# EasyEDA schematic BattleBoard.json

## Sheets
1 MCU: TITLE: MCU; REV: 1.0; Date: 2020-04-01; Sheet: 1/1; Drawn By: woodrowdouglass; Company: Your Company
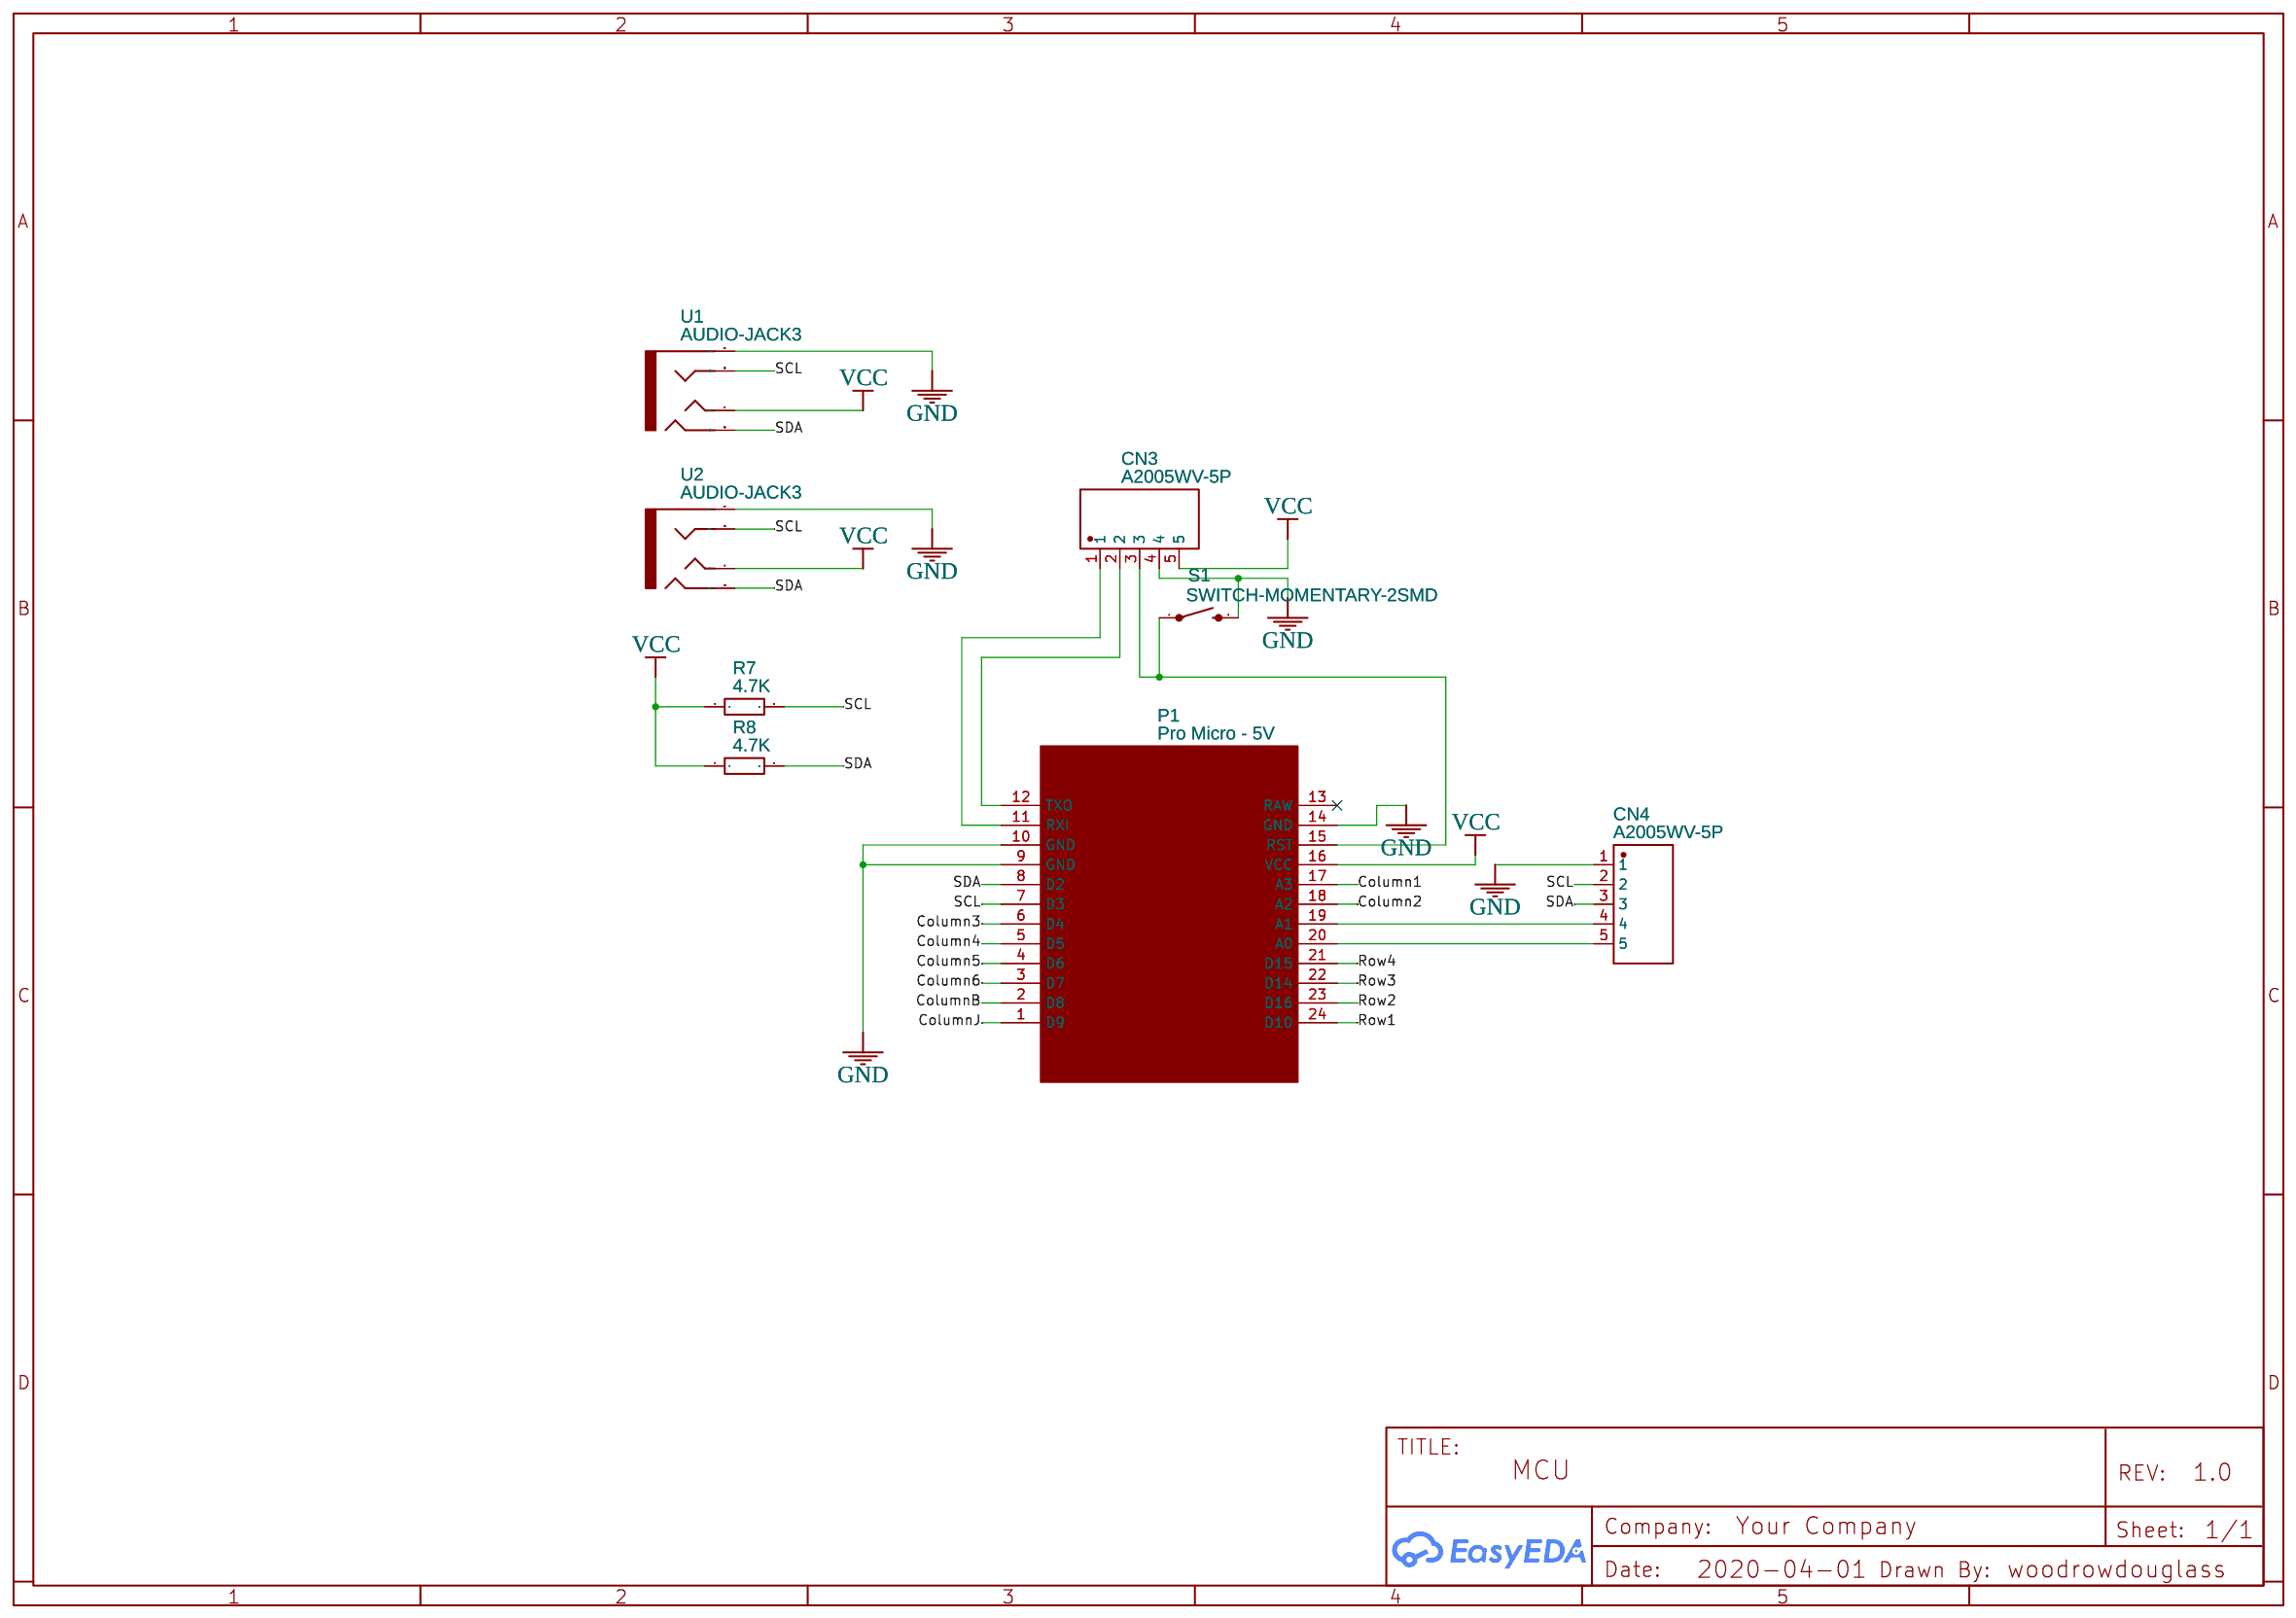
[diagram p0: MCU]
2 ArcadeControls: TITLE: Arcade Controls
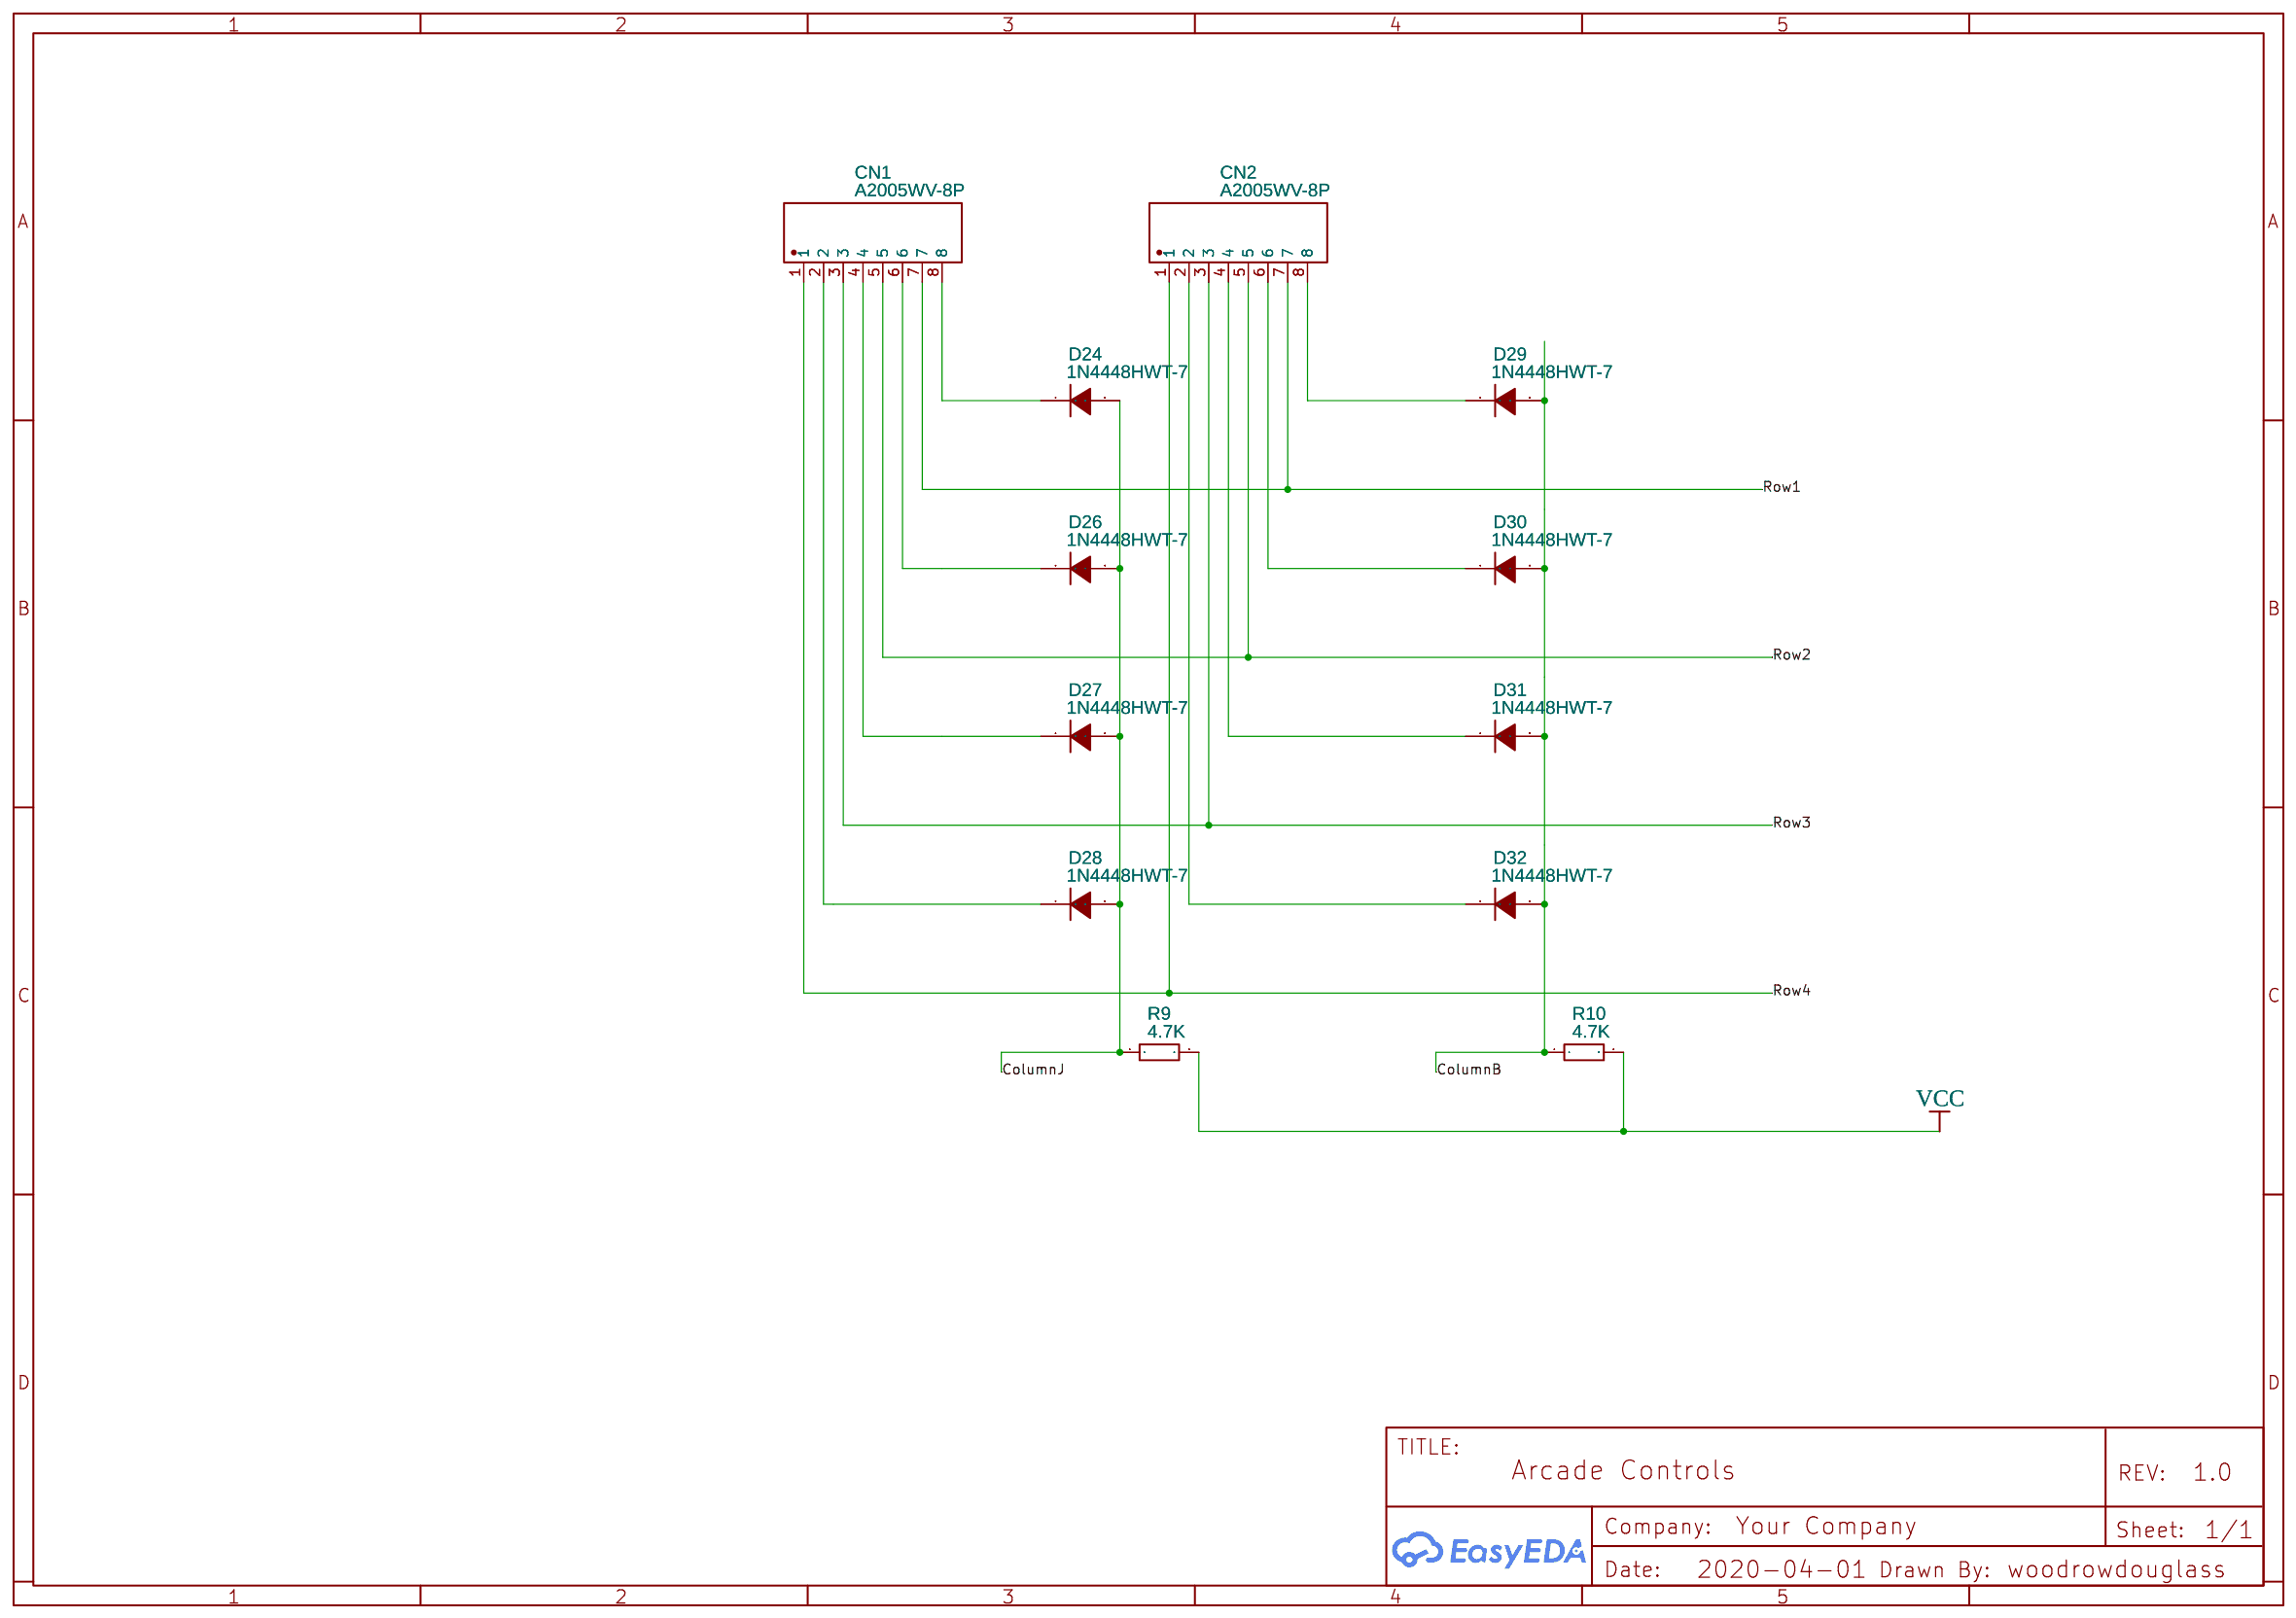
[diagram p1: ArcadeControls]
3 KeyMatrix: TITLE: KeyMatrix; Date: 2019-04-03
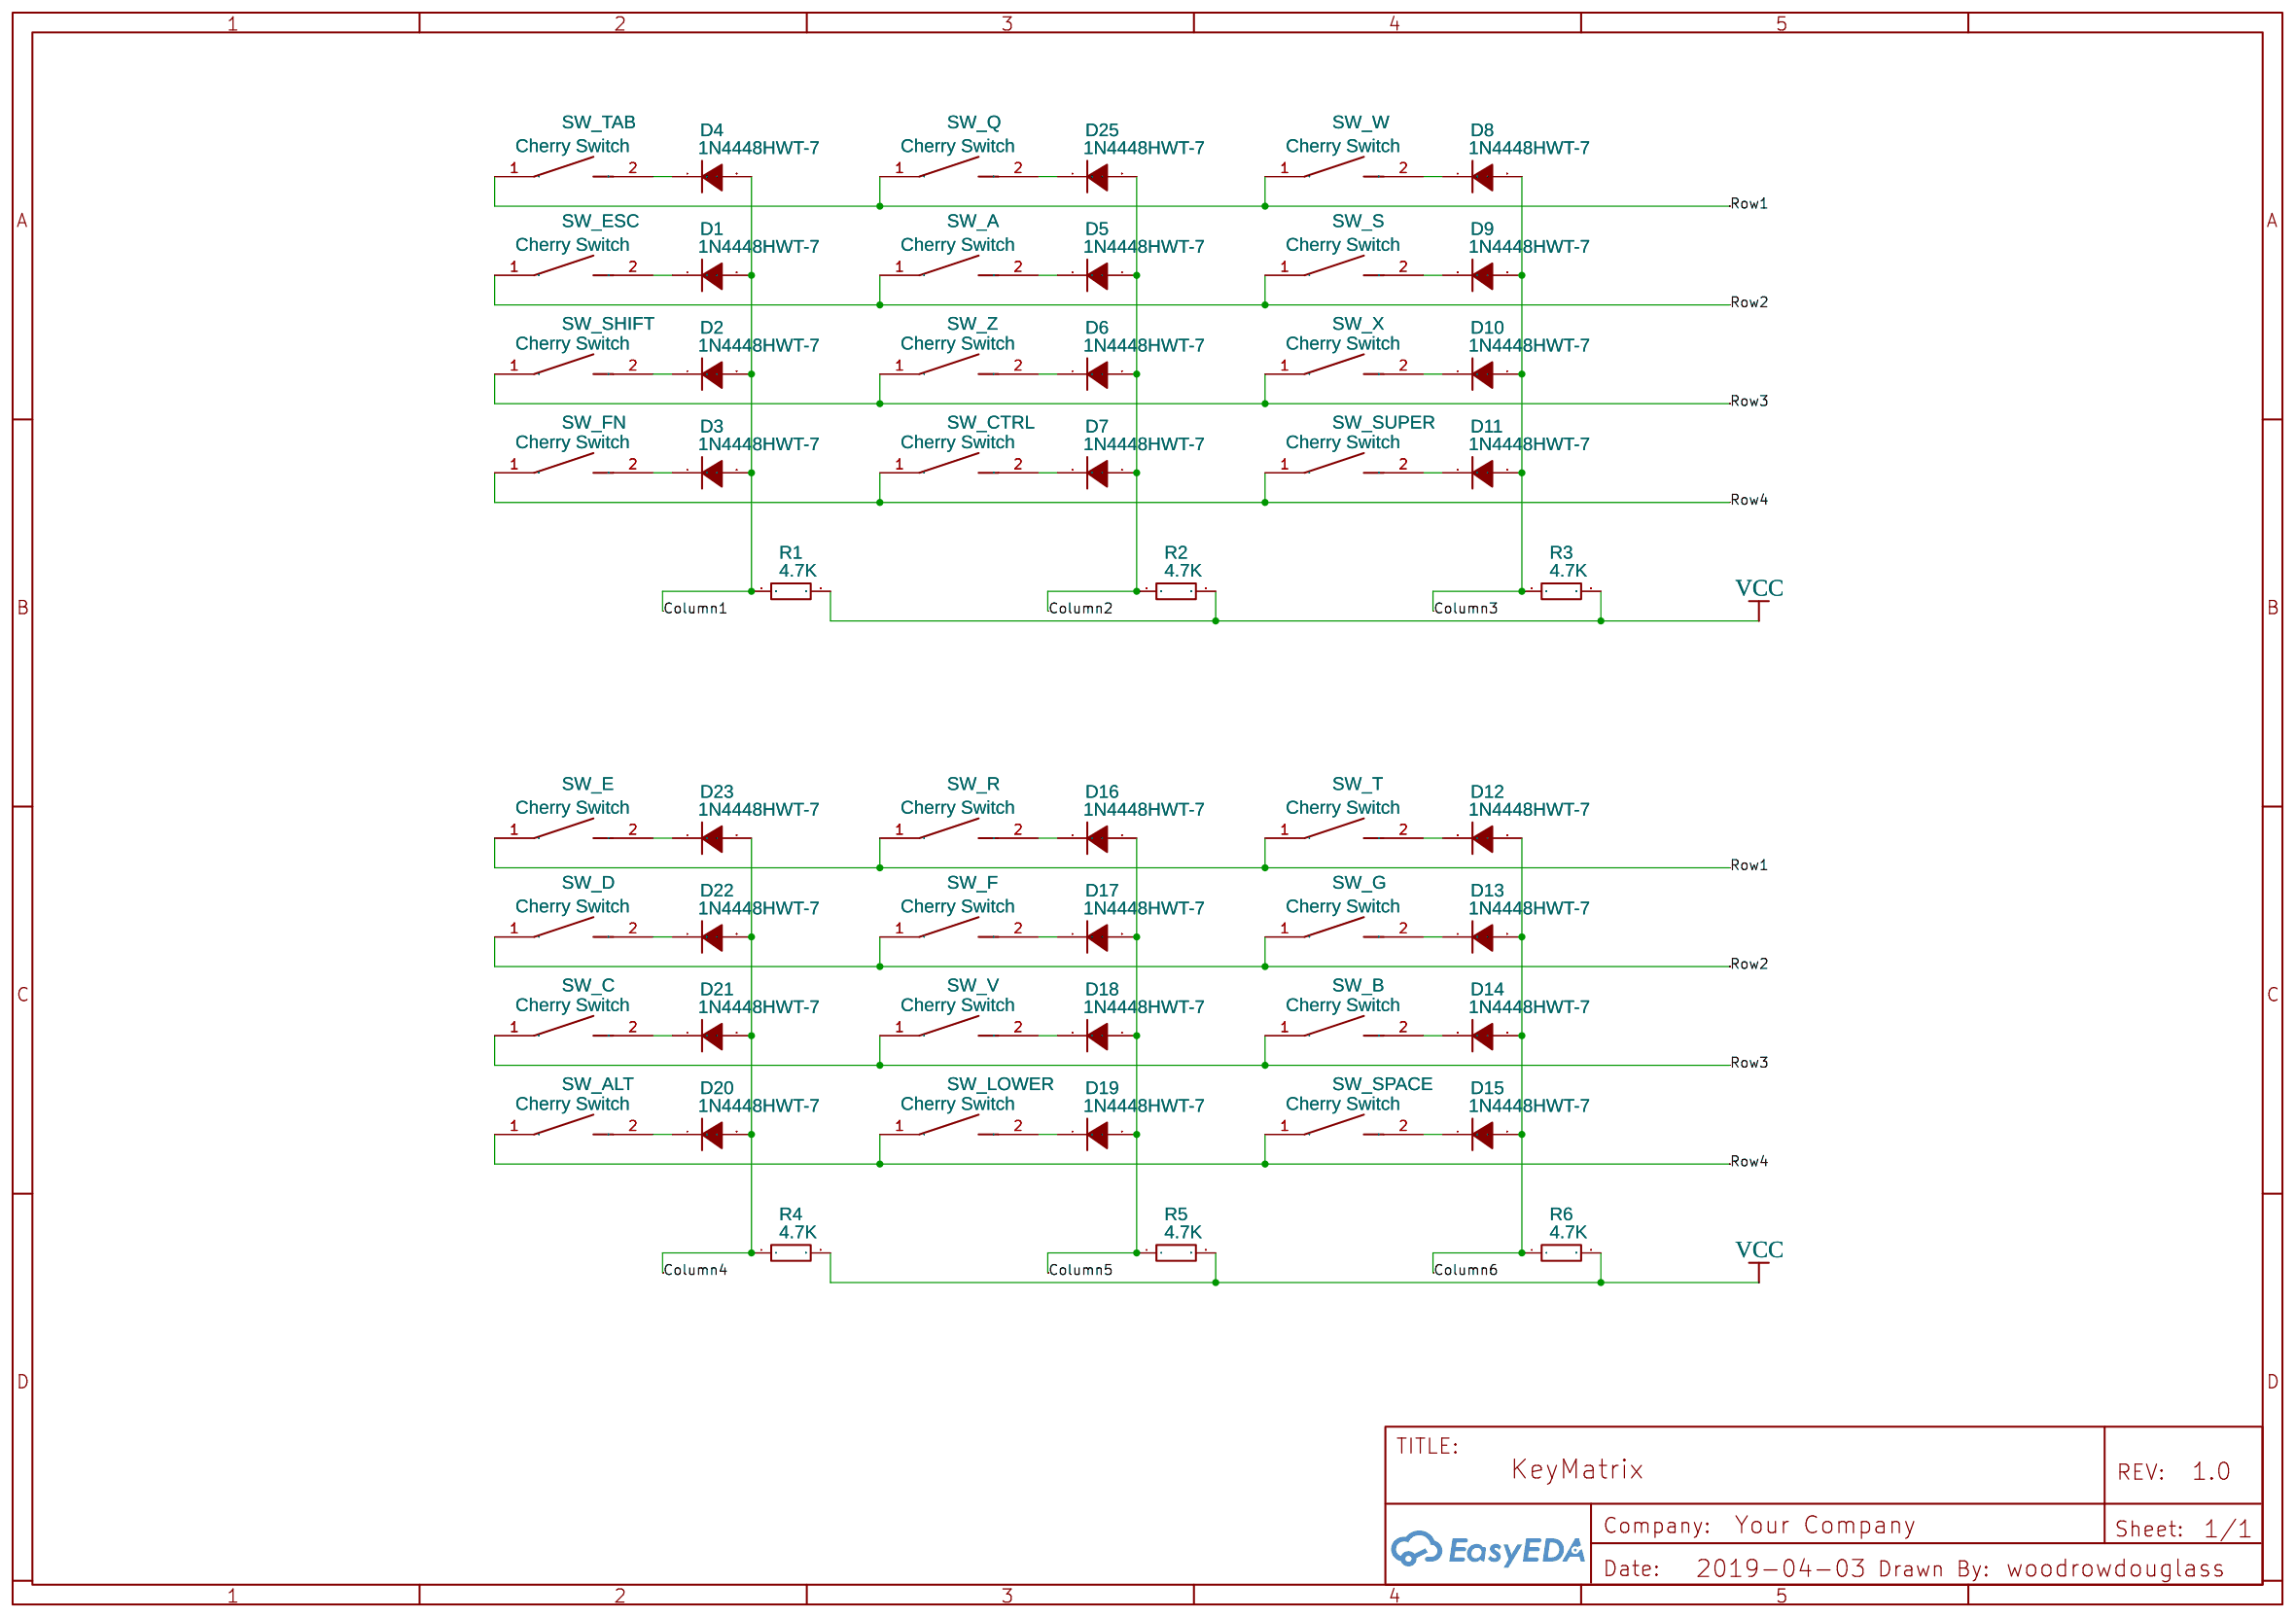
[diagram p2: KeyMatrix]

## Parts
sheet ArcadeControls
CN1  A2005WV-8P  [HDR-TH_8P-P2.00-V]
CN2  A2005WV-8P  [HDR-TH_8P-P2.00-V]
D24  1N4448HWT-7  [SOD-523_L1.2-W0.8-LS1.6-RD]
D26  1N4448HWT-7  [SOD-523_L1.2-W0.8-LS1.6-RD]
D27  1N4448HWT-7  [SOD-523_L1.2-W0.8-LS1.6-RD]
D28  1N4448HWT-7  [SOD-523_L1.2-W0.8-LS1.6-RD]
D29  1N4448HWT-7  [SOD-523_L1.2-W0.8-LS1.6-RD]
D30  1N4448HWT-7  [SOD-523_L1.2-W0.8-LS1.6-RD]
D31  1N4448HWT-7  [SOD-523_L1.2-W0.8-LS1.6-RD]
D32  1N4448HWT-7  [SOD-523_L1.2-W0.8-LS1.6-RD]
R9  4.7K  [R0402]
R10  4.7K  [R0402]
sheet KeyMatrix
D1  1N4448HWT-7  [SOD-523_L1.2-W0.8-LS1.6-RD]
D2  1N4448HWT-7  [SOD-523_L1.2-W0.8-LS1.6-RD]
D3  1N4448HWT-7  [SOD-523_L1.2-W0.8-LS1.6-RD]
D4  1N4448HWT-7  [SOD-523_L1.2-W0.8-LS1.6-RD]
D5  1N4448HWT-7  [SOD-523_L1.2-W0.8-LS1.6-RD]
D6  1N4448HWT-7  [SOD-523_L1.2-W0.8-LS1.6-RD]
D7  1N4448HWT-7  [SOD-523_L1.2-W0.8-LS1.6-RD]
D8  1N4448HWT-7  [SOD-523_L1.2-W0.8-LS1.6-RD]
D9  1N4448HWT-7  [SOD-523_L1.2-W0.8-LS1.6-RD]
D10  1N4448HWT-7  [SOD-523_L1.2-W0.8-LS1.6-RD]
D11  1N4448HWT-7  [SOD-523_L1.2-W0.8-LS1.6-RD]
D12  1N4448HWT-7  [SOD-523_L1.2-W0.8-LS1.6-RD]
D13  1N4448HWT-7  [SOD-523_L1.2-W0.8-LS1.6-RD]
D14  1N4448HWT-7  [SOD-523_L1.2-W0.8-LS1.6-RD]
D15  1N4448HWT-7  [SOD-523_L1.2-W0.8-LS1.6-RD]
D16  1N4448HWT-7  [SOD-523_L1.2-W0.8-LS1.6-RD]
D17  1N4448HWT-7  [SOD-523_L1.2-W0.8-LS1.6-RD]
D18  1N4448HWT-7  [SOD-523_L1.2-W0.8-LS1.6-RD]
D19  1N4448HWT-7  [SOD-523_L1.2-W0.8-LS1.6-RD]
D20  1N4448HWT-7  [SOD-523_L1.2-W0.8-LS1.6-RD]
D21  1N4448HWT-7  [SOD-523_L1.2-W0.8-LS1.6-RD]
D22  1N4448HWT-7  [SOD-523_L1.2-W0.8-LS1.6-RD]
D23  1N4448HWT-7  [SOD-523_L1.2-W0.8-LS1.6-RD]
D25  1N4448HWT-7  [SOD-523_L1.2-W0.8-LS1.6-RD]
R1  4.7K  [R0402]
R2  4.7K  [R0402]
R3  4.7K  [R0402]
R4  4.7K  [R0402]
R5  4.7K  [R0402]
R6  4.7K  [R0402]
SW_A  Cherry Switch  [CHERRY MX]
SW_ALT  Cherry Switch  [CHERRY MX]
SW_B  Cherry Switch  [CHERRY MX]
SW_C  Cherry Switch  [CHERRY MX]
SW_CTRL  Cherry Switch  [CHERRY MX]
SW_D  Cherry Switch  [CHERRY MX]
SW_E  Cherry Switch  [CHERRY MX]
SW_ESC  Cherry Switch  [CHERRY MX]
SW_F  Cherry Switch  [CHERRY MX]
SW_FN  Cherry Switch  [CHERRY MX]
SW_G  Cherry Switch  [CHERRY MX]
SW_LOWER  Cherry Switch  [CHERRY MX]
SW_Q  Cherry Switch  [CHERRY MX]
SW_R  Cherry Switch  [CHERRY MX]
SW_S  Cherry Switch  [CHERRY MX]
SW_SHIFT  Cherry Switch  [CHERRY MX]
SW_SPACE  Cherry Switch  [CHERRY MX]
SW_SUPER  Cherry Switch  [CHERRY MX]
SW_T  Cherry Switch  [CHERRY MX]
SW_TAB  Cherry Switch  [CHERRY MX]
SW_V  Cherry Switch  [CHERRY MX]
SW_W  Cherry Switch  [CHERRY MX]
SW_X  Cherry Switch  [CHERRY MX]
SW_Z  Cherry Switch  [CHERRY MX]
sheet MCU
CN3  A2005WV-5P  [HDR-TH_5P-P2.00-V]
CN4  A2005WV-5P  [HDR-TH_5P-P2.00-V]
P1  Pro Micro - 5V  [PRO MICRO - 5V]
R7  4.7K  [R0402]
R8  4.7K  [R0402]
S1  SWITCH-MOMENTARY-2SMD  [TACTILE-SWITCH-SMD]
U1  AUDIO-JACK3  [AUDIO-JACK-TRRS-SMD]
U2  AUDIO-JACK3  [AUDIO-JACK-TRRS-SMD]

## Library data of the parts
CN1 CN2 = A2005WV-8P: Supplier: LCSC; Supplier Part: C225260; Manufacturer: Changjiang Connectors; Contributor: LCSC
D1-D32 = 1N4448HWT-7: Supplier: LCSC; Supplier Part: C139447; Manufacturer: Diodes Incorporated; Contributor: LCSC; LCSC Assembly: Yes; SMT Type: Extend
R1-R10 = RMC1/16S-472JTH-M: Supplier: LCSC; Supplier Part: C340535; Manufacturer: KAMAYA; Contributor: LCSC
SW_A SW_ALT SW_B SW_C SW_CTRL SW_D SW_E SW_ESC SW_F SW_FN SW_G SW_LOWER SW_Q SW_R SW_S SW_SHIFT SW_SPACE SW_SUPER SW_T SW_TAB SW_V SW_W SW_X SW_Z = CHERRY_MX_LABELED: Manufacturer Part: CHERRY; Contributor: drummdan; Supplier: Reichelt
CN3 CN4 = A2005WV-5P: Supplier: LCSC; Supplier Part: C225257; Manufacturer: Changjiang Connectors; Contributor: LCSC
P1 = -: sourceId: 1T5FDZYC8; Manufacturer Part: ?
S1 = SWITCH-MOMENTARY-2SMD: Various NO switches- pushbuttons, reed, etc; Contributor: SparkFun
U1 U2 = AUDIO-JACK3: Contributor: SparkFun

## Nets
GND: CN3.4 CN4.1 P1.9(GND) P1.10(GND) P1.14(GND) S1.3(2) U1.EARTH U2.EARTH
VCC: CN3.5 P1.16(VCC) R1.2 R2.2 R3.2 R4.2 R5.2 R6.2 R7.1 R8.1 R9.2 R10.2 U1.TIP U2.TIP
Column1: D1.2(A) D2.2(A) D3.2(A) D4.2(A) P1.17(A3) R1.1
Column2: D5.2(A) D6.2(A) D7.2(A) D25.2(A) P1.18(A2) R2.1
Column3: D8.2(A) D9.2(A) D10.2(A) D11.2(A) P1.6(D4) R3.1
Column4: D20.2(A) D21.2(A) D22.2(A) D23.2(A) P1.5(D5) R4.1
Column5: D16.2(A) D17.2(A) D18.2(A) D19.2(A) P1.4(D6) R5.1
Column6: D12.2(A) D13.2(A) D14.2(A) D15.2(A) P1.3(D7) R6.1
ColumnB: D29.2(A) D30.2(A) D31.2(A) D32.2(A) P1.2(D8) R10.1
ColumnJ: D24.2(A) D26.2(A) D27.2(A) D28.2(A) P1.1(D9) R9.1
Row1: CN1.7 CN2.7 P1.24(D10) SW_E.1 SW_Q.1 SW_R.1 SW_T.1 SW_TAB.1 SW_W.1
Row2: CN1.5 CN2.5 P1.23(D16) SW_A.1 SW_D.1 SW_ESC.1 SW_F.1 SW_G.1 SW_S.1
Row3: CN1.3 CN2.3 P1.22(D14) SW_B.1 SW_C.1 SW_SHIFT.1 SW_V.1 SW_X.1 SW_Z.1
Row4: CN1.1 CN2.1 P1.21(D15) SW_ALT.1 SW_CTRL.1 SW_FN.1 SW_LOWER.1 SW_SPACE.1 SW_SUPER.1
SCL: CN4.2 P1.7(D3) R7.2 U1.RING1 U2.RING1
SDA: CN4.3 P1.8(D2) R8.2 U1.RING2 U2.RING2
Net-(CN1-2): CN1.2 D28.1(C)
Net-(CN1-4): CN1.4 D27.1(C)
Net-(CN1-6): CN1.6 D26.1(C)
Net-(CN1-8): CN1.8 D24.1(C)
Net-(CN2-2): CN2.2 D32.1(C)
Net-(CN2-4): CN2.4 D31.1(C)
Net-(CN2-6): CN2.6 D30.1(C)
Net-(CN2-8): CN2.8 D29.1(C)
Net-(CN3-1): CN3.1 P1.11(RXI)
Net-(CN3-2): CN3.2 P1.12(TXO)
Net-(CN3-3): CN3.3 P1.15(RST) S1.1
Net-(CN4-4): CN4.4 P1.19(A1)
Net-(CN4-5): CN4.5 P1.20(A0)
Net-(D1-1): D1.1(C) SW_ESC.2
Net-(D2-1): D2.1(C) SW_SHIFT.2
Net-(D3-1): D3.1(C) SW_FN.2
Net-(D4-1): D4.1(C) SW_TAB.2
Net-(D5-1): D5.1(C) SW_A.2
Net-(D6-1): D6.1(C) SW_Z.2
Net-(D7-1): D7.1(C) SW_CTRL.2
Net-(D8-1): D8.1(C) SW_W.2
Net-(D9-1): D9.1(C) SW_S.2
Net-(D10-1): D10.1(C) SW_X.2
Net-(D11-1): D11.1(C) SW_SUPER.2
Net-(D12-1): D12.1(C) SW_T.2
Net-(D13-1): D13.1(C) SW_G.2
Net-(D14-1): D14.1(C) SW_B.2
Net-(D15-1): D15.1(C) SW_SPACE.2
Net-(D16-1): D16.1(C) SW_R.2
Net-(D17-1): D17.1(C) SW_F.2
Net-(D18-1): D18.1(C) SW_V.2
Net-(D19-1): D19.1(C) SW_LOWER.2
Net-(D20-1): D20.1(C) SW_ALT.2
Net-(D21-1): D21.1(C) SW_C.2
Net-(D22-1): D22.1(C) SW_D.2
Net-(D23-1): D23.1(C) SW_E.2
Net-(D25-1): D25.1(C) SW_Q.2

Not connected (* = marked no-connect by the designer): P1 13(RAW)*
